# EAGLE design fredisp (EAGLE 6.1)
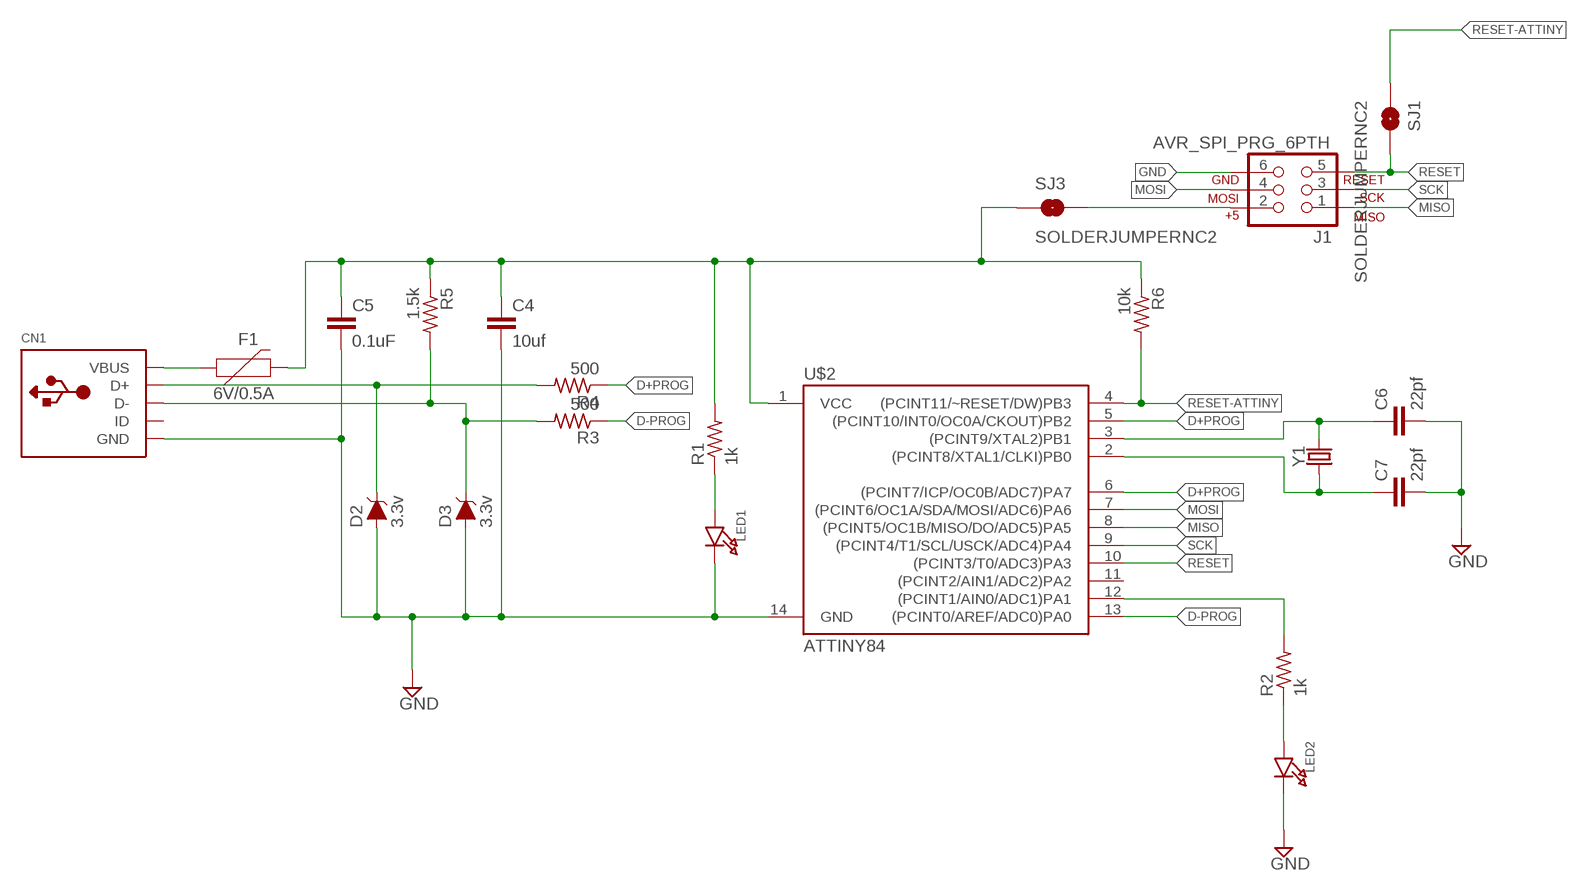
[diagram p0: schematic, sheet 1]

## Parts
C4  10uf  C-EUC1206  [C1206]
C5  0.1uF  C-EUC0805  [C0805]
C6  22pf  C-EUC0805  [C0805]
C7  22pf  C-EUC0805  [C0805]
CN1  USBMINIB  [USB-MINIB]
D2  3.3v  DIODE-ZENER-DZ2J150M0L  [PANASONIC_SMINI2-F5-B]
D3  3.3v  DIODE-ZENER-DZ2J150M0L  [PANASONIC_SMINI2-F5-B]
F1  6V/0.5A  PPTC_HALF-AMP  [1206]
J1  AVR_SPI_PRG_6PTH  [2X3]
LED1  LED0805  [CHIPLED_0805]
LED2  LED0805  [CHIPLED_0805]
R1  1k  R-US_R0805  [R0805]
R2  1k  R-US_R0805  [R0805]
R3  500  R-US_R0805  [R0805]
R4  500  R-US_R0805  [R0805]
R5  1.5k  R-US_R0805  [R0805]
R6  10k  R-US_R0805  [R0805]
SJ1  SOLDERJUMPERNC2  [SJ_2S-NOTRACE]
SJ3  SOLDERJUMPERNC2  [SJ_2S-NOTRACE]
U$2  ATTINY84  [SO14]
Y1  CRYSTALSMD-3.2X2.5  [CRYSTAL-SMD-3.2X2.5MM]

## Nets
D+PROG: R4.1 U$2.5((PCINT10/INT0/OC0A/CKOUT)PB2) U$2.6((PCINT7/ICP/OC0B/ADC7)PA7)
D-PROG: R3.1 U$2.13((PCINT0/AREF/ADC0)PA0)
GND: C4.2 C5.2 C6.2 C7.2 CN1.GND D2.A D3.A J1.6 LED1.C LED2.C U$2.14(GND)
MISO: J1.1 U$2.8((PCINT5/OC1B/MISO/DO/ADC5)PA5)
MOSI: J1.4 U$2.7((PCINT6/OC1A/SDA/MOSI/ADC6)PA6)
N$1: C6.1 U$2.3((PCINT9/XTAL2)PB1) Y1.3
N$2: CN1.D- D3.C R3.2 R5.2
N$3: CN1.D+ D2.C R4.2
N$4: C7.1 U$2.2((PCINT8/XTAL1/CLKI)PB0) Y1.1
N$5: J1.2 SJ3.2
N$6: CN1.VBUS F1.1
N$7: LED1.A R1.1
N$8: LED2.A R2.1
N$11: R2.2 U$2.12((PCINT1/AIN0/ADC1)PA1)
RESET: J1.5 SJ1.2 U$2.10((PCINT3/T0/ADC3)PA3)
RESET-ATTINY: R6.2 SJ1.1 U$2.4((PCINT11/~RESET/DW)PB3)
SCK: J1.3 U$2.9((PCINT4/T1/SCL/USCK/ADC4)PA4)
VCC: C4.1 C5.1 F1.2 R1.2 R5.1 R6.1 SJ3.1 U$2.1(VCC)
Unconnected: CN1.ID U$2.11((PCINT2/AIN1/ADC2)PA2)

## Library data of the parts
C4 = rcl:C-EU: CAPACITOR, European symbol
C5-C7 = resistor:C-EU: CAPACITOR, European symbol
CN1 = adafruit:USB: USB Connectors USBMINIB - Surface Mount Female Mini-B USB Connector [Part No.] 4UConnector: 06564 By microbuilder.eu
D2 D3 = SparkFun-DiscreteSemi:DIODE-ZENER: Zener Diode A Zener diode allows current to flow from its anode to its cathode like a normal semiconductor diode, but it also permits current to flow in the reverse direction when its "Zener voltage" is reached. - WIkipedia; PROD_ID: DIO-12989; VALUE: 15V
F1 = SparkFun-Fuses:PPTC: Resettable Fuse PPTC Resettable Fuse. Really a sort of resistor with a polymeric positive temperature coefficient whose resistance increases dramatically with an increase in temperature. When heated by the power passing through the resistance rises causing the current to be limited, protecting the circuit. This is achieved by the transition of the polymer from a crystalline to an amorphous state where the conductive carbon separates breaking the conductive pathways found in the cool crystalline structure. When a PPTC cools back down it resumes conducting letting the circuit turn back on. SparkFun Products: SparkFun RedBoard - Programmed with Arduino <https://www.sparkfun.com/products/12757> Pro Micro - 5V/16MHz <https://www.sparkfun.com/products/12640> Arduino Pro 328 - 5V/16MHz <https://www.sparkfun.com/products/10915> MP3 Trigger <https://www.sparkfun.com/products/13720>; PROD_ID: RES-08585
J1 = SparkFun-Connectors:AVR_SPI_PRG_6: AVR ISP 6 Pin This is the reduced ISP connector for AVR programming. Common on Arduino. This footprint will take up less PCB space and can be used with a 10-pin to 6-pin adapter such as SKU: BOB-08508 **Special note about "TEST_POINT" package. The stop mask is on the top side, so if you want your programming test points to be on the bottom of your board, make sure to place this package on the bottom side of the board. This also ensure that the orientation to program from the bottom side will be correct.
LED1 LED2 = microbuilder:LED: LED 0603 - 0603 Surface Mount Package 2mA: Green LED - Low Power (3.9mcd, 2ma, 1.7Vf) - Digikey: 475-2709-2-ND Orange LED - Low Power (9.8mcd, 2ma, 1.8Vf) - Digikey: 475-1194-2-ND Red LED - Low Power (5mcd, 2ma, 1.8Vf) - Digikey: 475-1195-2-ND Yellow LED - Low Power (7mcd, 2ma, 1.8Vf) - Digikey: 475-1196-2-ND 5mA: Blue LED - Low Power (17mcd, 5ma, 2.9Vf) - Digikey: LNJ937W8CRACT-ND 0805 - 0805 Surface Mount Package 2mA: Red LED (8.8mcd, 2mA, 1.8Vf, Clear) - Low Power [Digikey: 475-2510-1-ND] Green LED (5mcd, 2mA, 1.8Vf, Clear) - Low Power [Digikey: 475-2730-1-ND] Yellow LED (11.3mcd, 2mA, 1.8Vf, Clear) - Low Power [Digikey: 475-2555-1-ND] 20mA: Red LED (104mcd, 20mA, Diffused) - LS R976 [Digikey: 475-1278-6-ND] Red LED (12mcd, 20mA, 2.0Vf, Clear) - APT2012EC [Digikey: 754-1128-1-ND] Green LED (15mcd, 20mA, 2.2Vf, Clear) - APT2012GC [Digikey: 754-1131-1-ND] Orange LED (160mcd, 20mA, 2.1Vf, Clear) - APT2012SECK [Digikey: 754-1130-1-ND] 1206 - 1206 Surface Mount Package Green LED (26mcd, 20mA, Diffused) - LG N971 [Digikey: 475-1407-6-ND] Red LED (15mcd, 20mA, Diffused) - LH N974 [Digikey: 475-1416-6-ND]
R1-R6 = adafruit:R-US_: RESISTOR, American symbol
SJ1 SJ3 = SparkFun-Retired:SOLDERJUMPER: Solder Jumper Standard SMD solder jumper. Used to automate production. Two varients : Normally Open and Normally Closed are the same, but have different paste layers. NC will have a large amount of paste and should jumper during reflow.
U$2 = SparkFun-IC-Microcontroller:ATTINY84: Atmel 14-pin 2/4/8kB flash uC Datasheet <https://cdn.sparkfun.com/datasheets/Widgets/doc8006.pdf> SparkFun Products Tiny AVR Programmer <https://www.sparkfun.com/products/11801> (PGM-11801) SparkFun Servo Trigger - Continuous Rotation <https://www.sparkfun.com/products/13872> (WIG-13872) SparkFun Servo Trigger <https://www.sparkfun.com/products/13118> (WIG-13118); PROD_ID: IC-11285
Y1 = SparkFun-Clocks:CRYSTAL: Crystals (Generic) These are passive quartz crystals, which can be used as a clock source for a microcontroller. Crystal's are two-terminal devices. They require external "load" capacitors to generate an oscillating signal.

## Board
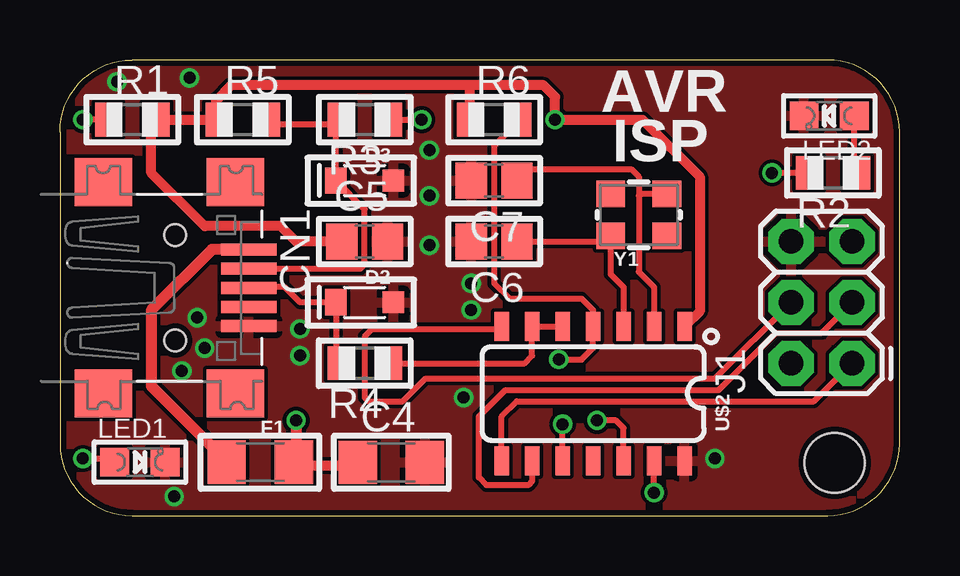
[diagram p1: board, top side]
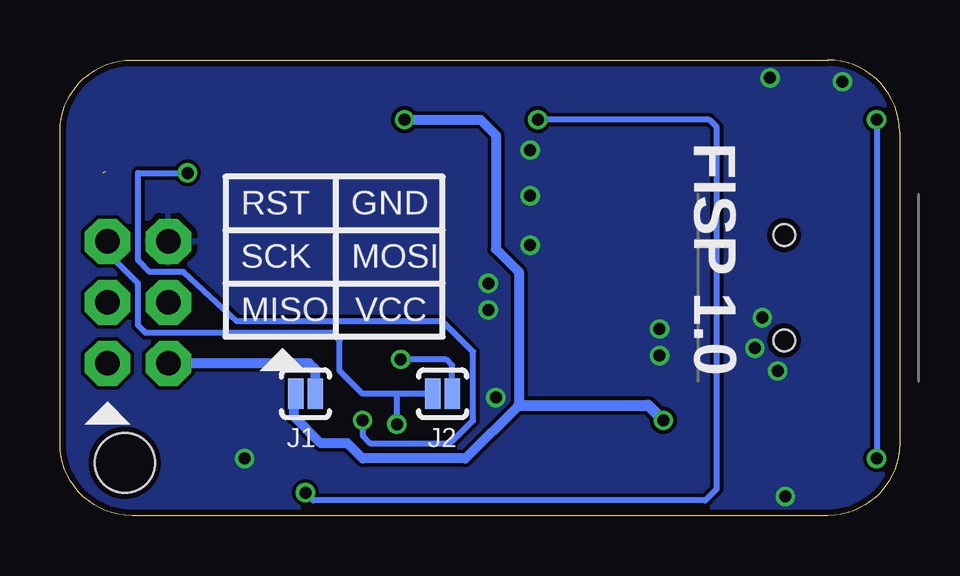
[diagram p2: board, bottom side, seen from below]

Size 35 x 19 mm. Coordinates in mm from the lower left corner, seen from the top.
Outline: 3,0 32,0 arc90 35,3 35,16 arc90 32,19 3,19 arc90 0,16 0,3 arc90 3,0
Copper layers (1*16): Top 0.035mm / dielectric 1.5mm / Bottom 0.035mm
Design rules: minimum track width 6mil, minimum drill 12mil, track to track 6mil, track to pad 6mil, pad to pad 6mil, via to via 6mil, smd to smd 0mil, copper to edge 10mil, drill to drill 10mil, minimum pad ring 10mil, minimum via ring 6mil, stop-mask expansion 2mil, vias tented up to drill 100mil, thermal gap 10mil
Holes 2.5 mm at 32.3,2.2

### Footprints (pad centres in the part's own frame; a part is rotated, then mirrored left to right if it is on the bottom)
C1206 = smd 1.6 x 1.8: 1 -1.4,0; 2 1.4,0
C0805 = smd 1.3 x 1.5: 1 -0.95,0; 2 0.95,0
USB-MINIB = smd 0.5 x 2.308: D+ 0,4.064; D- -0.8,4.064; GND 1.6,4.064; ID 0.8,4.064; VBUS -1.6,4.064 | smd 2 x 2.4: GND1 -4.4,-2; GND2 -4.4,3.5; GND3 4.4,3.5; GND4 4.4,-2 | hole 0.9: -2.2,1; 2.2,1
PANASONIC_SMINI2-F5-B = smd 0.9 x 0.9: A 1.2,0 | smd 0.9 x 1.1: C -1.2,0
1206 = smd 1.6 x 1.8: 1 -1.4,0; 2 1.4,0
2X3 = drill 1.016 pad 1.88 octagon: 1 0,0; 2 0,2.54; 3 2.54,0; 4 2.54,2.54; 5 5.08,0; 6 5.08,2.54
CHIPLED_0805 = smd 1.2 x 1.2: A 0,-1.05; C 0,1.05
R0805 = smd 1.1 x 1.4: 1 -1,0; 2 1,0
SJ_2S-NOTRACE = smd 0.635 x 1.27: 1 -0.401,0; 2 0.413,0
SO14 = smd 0.6 x 1.2: 1 -3.175,-2.8; 2 -1.905,-2.8; 3 -0.635,-2.8; 4 0.635,-2.8; 5 1.905,-2.8; 6 3.175,-2.8; 7 4.445,-2.8; 8 4.445,2.8; 9 3.175,2.8; 10 1.905,2.8; 11 0.635,2.8; 12 -0.635,2.8; 13 -1.905,2.8; 14 -3.175,2.8
CRYSTAL-SMD-3.2X2.5MM = smd 1.2 x 1.1: 1 -1.175,-0.875; 2 1.175,-0.875; 3 1.175,0.875; 4 -1.175,0.875

### Placement (x,y rotation side)
C4  13.81,2.22 0 top
C5  12.7,11.43 0 top
C6  18.1,11.43 180 top
C7  18.1,13.97 180 top
CN1  3.81,9.5 270 top
D2  12.7,8.89 0 top
D3  12.7,13.97 0 top
F1  8.35,2.23 0 top
J1  33.02,6.35 90 top
LED1  3.33,2.23 270 top
LED2  32.07,16.67 90 top
R1  3.02,16.51 0 top
R2  32.23,14.29 180 top
R3  12.7,16.51 180 top
R4  12.7,6.35 180 top
R5  7.62,16.51 0 top
R6  18.1,16.51 0 top
SJ1  19.05,5.08 180 bottom
SJ3  24.77,5.08 0 bottom
U$2  22.86,5.08 180 top
Y1  24.13,12.54 180 top

### Tracks (layer width: path | path; a pad name or v marks a point on that pad's centre or on a via)
D+PROG
  Top 0.254: R4.1 19.37,6.35 19.68,6.67 U$2.6 U$2.5
D-PROG  (via drill 0.5)
  Top 0.254: v24.77,0.95 U$2.13 | R3.1 v15.08,16.51
  Bottom 0.254: v24.77,0.95 24.45,0.64 8.1,0.64 7.62,1.11 7.62,16.19 7.94,16.51 v15.08,16.51
GND  (via drill 0.5)
  other vias: 10,6.67 15.4,11.27 15.4,13.34 15.4,15.24 27.3,2.38 17.14,8.57 17.14,9.68 6.03,6.99 10,7.78 4.76,0.79 5.71,8.26 5.08,6.03 16.83,4.92 5.4,18.26 2.38,18.1
  pour Top: 0,19.05 35.08,19.05 35.58,-0.3 0,0
  pour Bottom: 0,19.05 35.08,19.05 35.38,-0.3 0,0
MISO
  Top 0.254: U$2.8 18.41,4.13 19.05,4.76 31.43,4.76 J1.1
MOSI
  Top 0.254: J1.4 27.3,5.71 15.24,5.71 14.29,4.76 12.86,4.76 12.7,4.92 12.7,7.46 13.02,7.78 18.36,7.78 U$2.7
N$1
  Top 0.254: U$2.3 23.5,9.53 22.95,10.06 Y1.3 22.72,11.43 C6.1
N$2
  Top 0.254: 11.5,16.31 D3.C 12.7,12.77 12.7,10.48 12.52,10.3 CN1.D- | 11.5,16.31 R3.2 | 11.5,16.31 8.82,16.31 R5.2
N$3
  Top 0.254: R4.2 11.5,6.55 D2.C 10,8.89 9.37,9.53 7.9,9.53 CN1.D+
N$4
  Top 0.254: 24.13,13.34 24.13,14.13 23.81,14.45 19.21,14.45 19.05,14.29 C7.1 | 24.13,13.34 24.13,10.16 24.77,9.53 U$2.2 | Y1.1 24.21,13.42 24.13,13.34
N$5
  Bottom 0.406: SJ3.2 24.35,6.1 24.61,6.35 J1.2
N$6
  Top 0.457: CN1.VBUS 6.34,11.1 3.81,8.57 3.81,5.4 6.51,2.7 6.51,2.51 F1.1
N$7  (via drill 0.5)
  Top 0.254: R1.1 v0.95,16.51 | v0.95,2.38 1.96,2.38 LED1.A
  Bottom 0.254: v0.95,16.51 v0.95,2.38
N$8  (1 unrouted)
  Top 0.254: 33.07,14.34 33.12,14.34 LED2.A
N$11  (via drill 0.5)
  Top 0.254: U$2.12 23.5,3.65 23.18,3.97 v22.38,3.97 | R2.2 v29.69,14.29
  Bottom 0.254: v22.38,3.97 22.38,3.33 22.07,3.02 18.73,3.02 17.78,3.97 17.78,6.83 19.05,8.1 27.62,8.1 29.84,10.16 31.27,10.16 31.75,10.64 31.75,14.29 v29.69,14.29
RESET  (via drill 0.5)
  Top 0.254: U$2.10 v20.95,3.81
  Bottom 0.254: SJ1.2 20.95,5.08 | 20.95,5.08 22.38,5.08 23.34,6.03 23.34,7.3 23.65,7.62 31.43,7.62 31.75,7.94 31.75,9.68 32.86,10.79 32.86,11.27 J1.5 | v20.95,3.81 20.95,5.08
RESET-ATTINY  (via drill 0.5)
  Top 0.254: R6.2 19.1,16.4 18.1,15.4 18.1,9.68 18.73,9.05 21.75,9.05 22.23,8.57 U$2.4 22.23,6.99 21.75,6.51 v20.8,6.51
  Bottom 0.254: SJ1.1 18.65,6.27 18.89,6.51 v20.8,6.51
SCK
  Top 0.254: U$2.9 19.68,1.43 19.53,1.27 17.78,1.27 17.46,1.59 17.46,4.13 18.57,5.24 27.46,5.24 29.84,7.62 31.75,7.62 J1.3
VCC  (via drill 0.5)
  Top 0.254: 11.42,11.1 C5.1 | 3.81,16.46 R1.2 | 6.51,16.62 R5.1
  Top 0.406: R1.2 R5.1 | 3.81,16.46 3.81,14.29 6.03,12.06 9.21,12.06 9.84,11.43 C5.1 | 17.14,17.94 20.16,17.94 20.64,17.46 v20.64,16.51 24.29,16.51 26.67,14.13 26.67,8.52 U$2.1 | 17.14,17.94 7.14,17.94 6.51,17.3 6.51,16.62 | R6.1 17.1,17.89 17.14,17.94 | C4.1 11.94,2.89 11.91,2.06 10.22,2.06 F1.2
  Top 0.457: v9.84,3.97 9.84,2.48 F1.2
  Bottom 0.406: v20.64,16.51 17.46,16.51 16.83,15.88 16.83,11.11 15.88,10.16 15.88,4.6 18.1,2.38 22.38,2.38 23.02,3.02 24.13,3.02 25.24,4.13 25.24,5 SJ3.1
  Bottom 0.457: 15.88,4.6 10.48,4.6 v9.84,3.97

### Text on the board
tPlace: AVR | ISP
bPlace: FISP 1.0
bNames: GND | RST | MOSI | SCK | VCC | MISO | J2 | J1